# EasyEDA Pro project can-mcu.eprj, schematic host-dev
Board Name: host-dev; Create Date: 2026-08-12; Page Name: P1; Project Name: can-mcu; Schematic Name: host-dev; Update Date: 2026-09-03; Company: EasyEDA.com; Page Size: A4; Version: V1.0
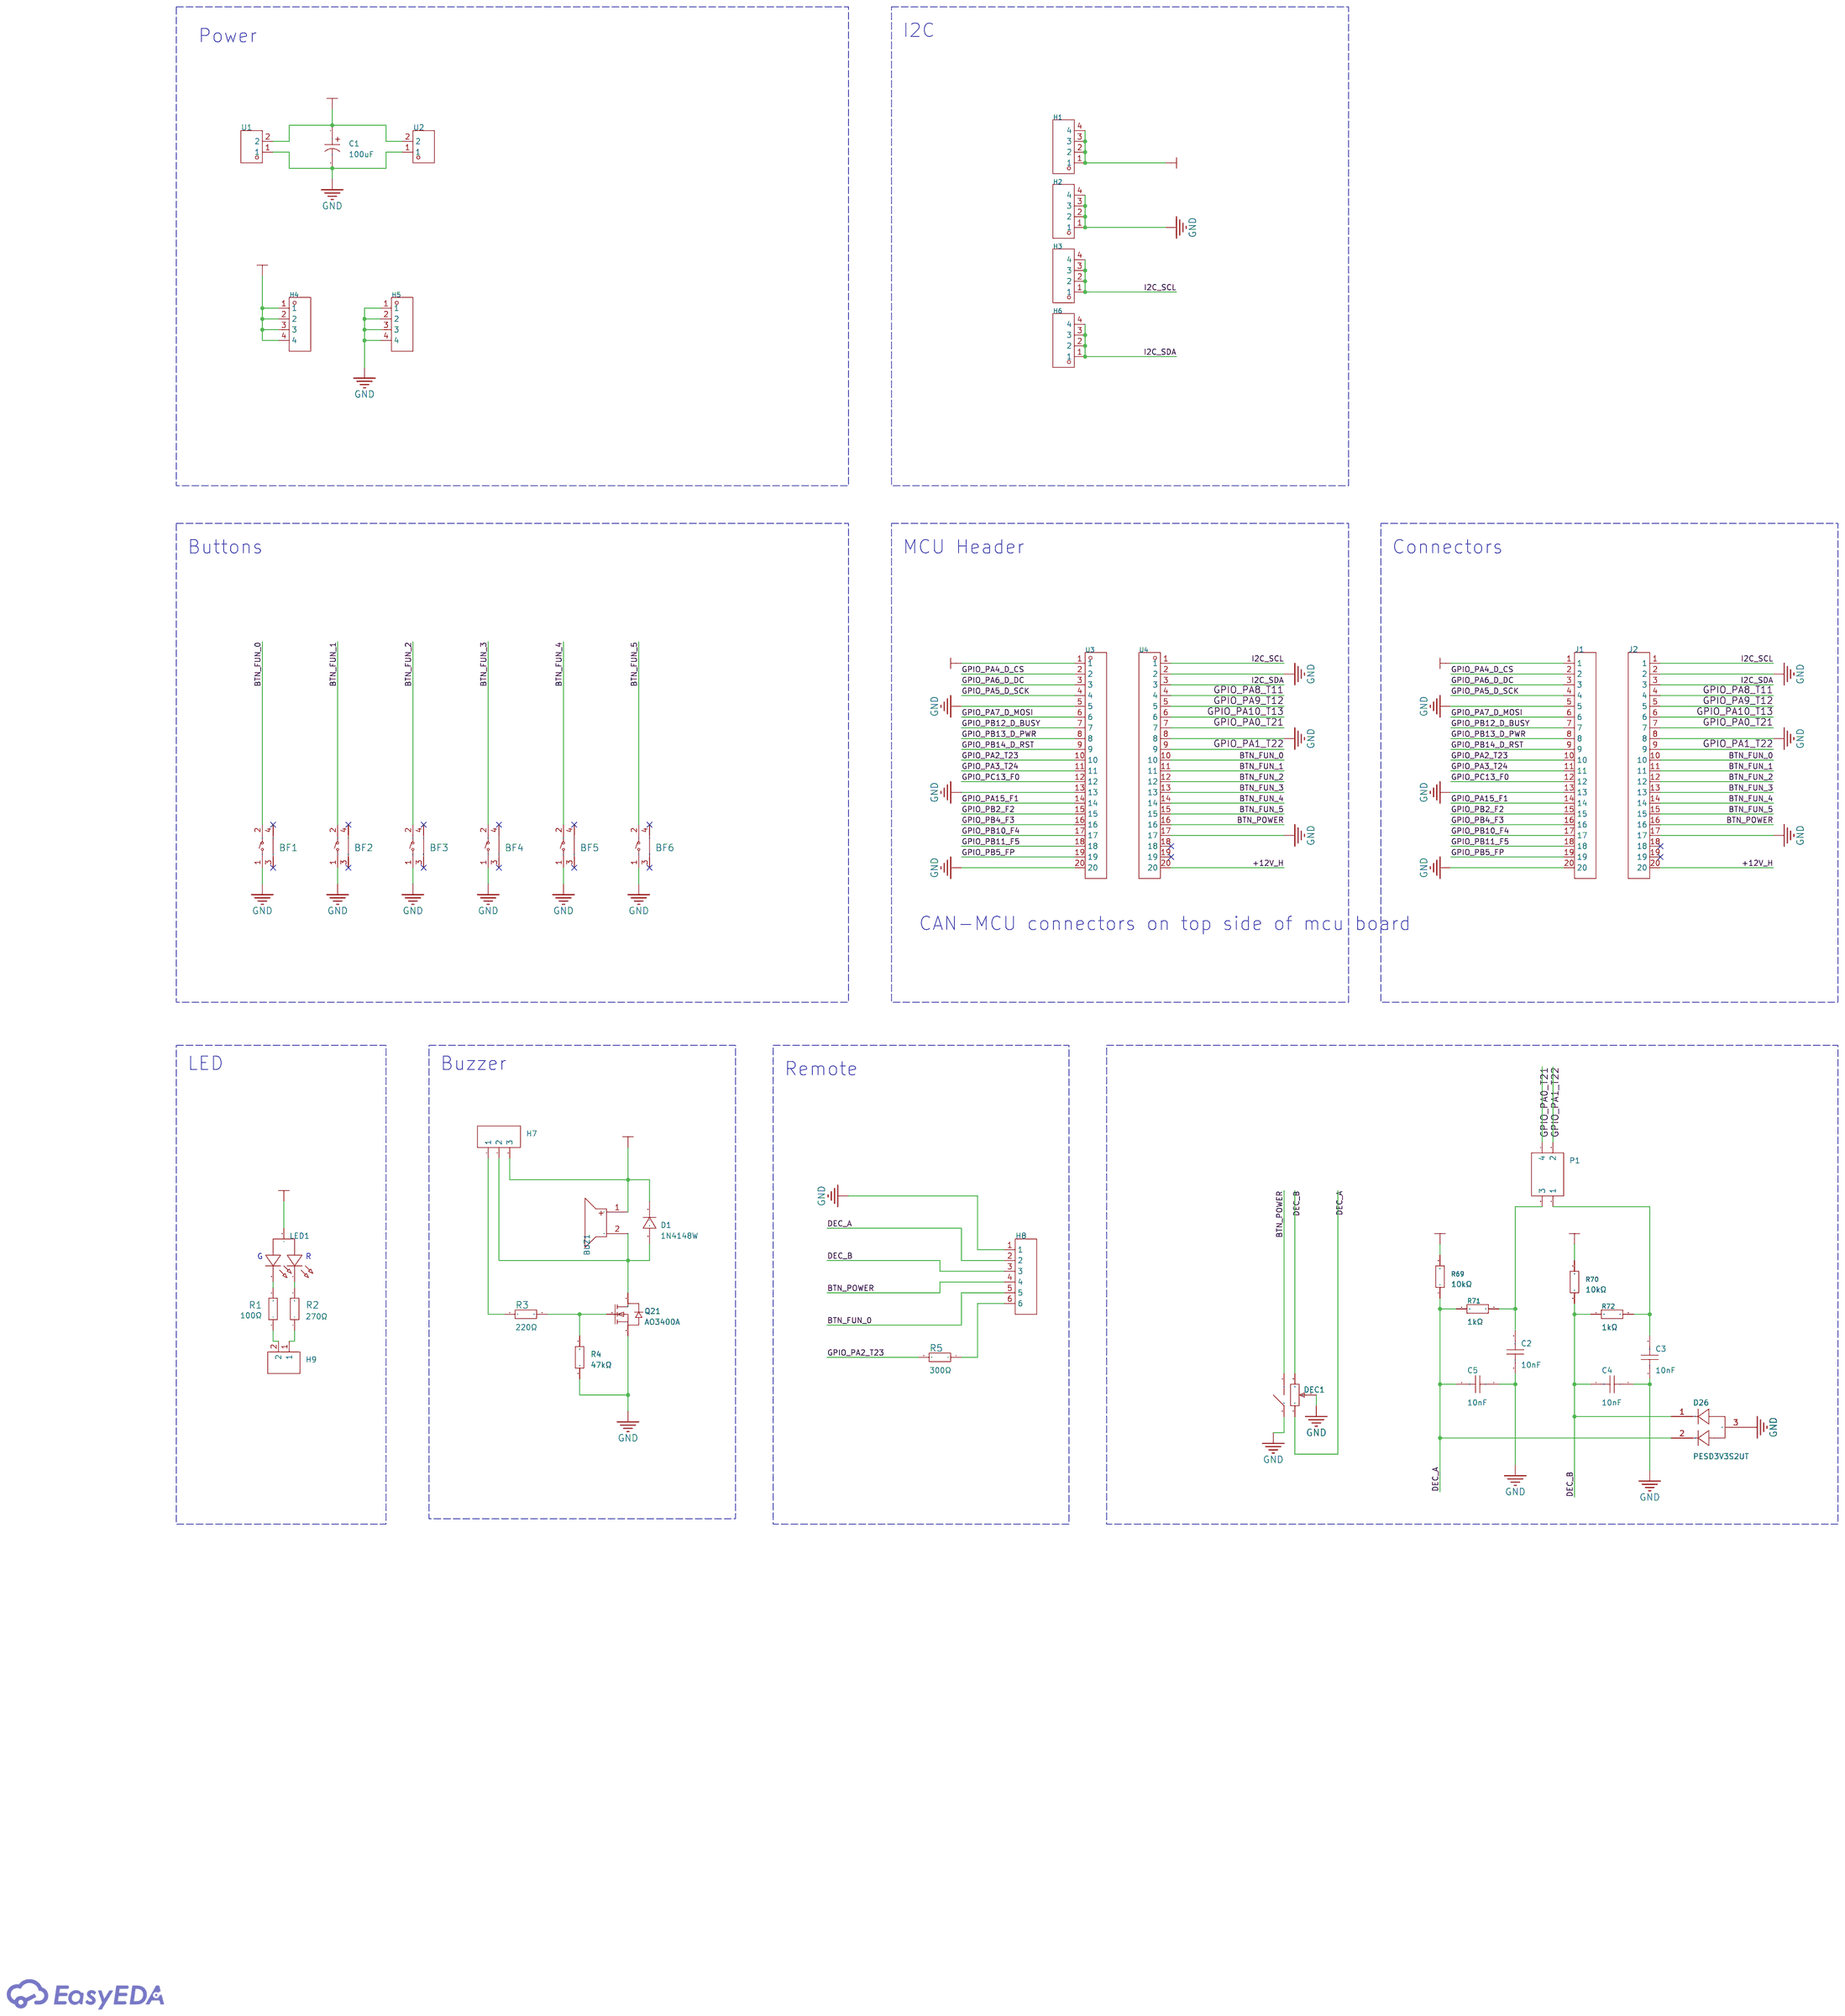
[diagram p2: schematic sheet]

## Parts
BF1  TC-6615-8-260G  [SW-TH_4P-L7.5-W8.0-P4.50]
BF2  TC-6615-8-260G  [SW-TH_4P-L7.5-W8.0-P4.50]
BF3  TC-6615-8-260G  [SW-TH_4P-L7.5-W8.0-P4.50]
BF4  TC-6615-8-260G  [SW-TH_4P-L7.5-W8.0-P4.50]
BF5  TC-6615-8-260G  [SW-TH_4P-L7.5-W8.0-P4.50]
BF6  TC-6615-8-260G  [SW-TH_4P-L7.5-W8.0-P4.50]
BUZ1  2.7kHz  [BUZ-TH_BD9.0-P4.00-D0.6-FD]
C1  100uF  [CAP-SMD_BD6.3-L6.6-W6.6-LS7.3-FD-H7.7]
C2  10nF  [C1206]
C3  10nF  [C1206]
C4  10nF  [C1206]
C5  10nF  [C1206]
D1  1N4148W  [SOD-123_L2.8-W1.8-LS3.7-RD]
D26  PESD3V3S2UT  [SOT-23-3_L2.9-W1.3-P1.90-LS2.4-BR]
DEC1  PEC09-2120K-T0012  [SW-TH_PEC09-2120K-T0012]
H1  PZ254V-11-04P  [HDR-TH_4P-P2.54-V-M]
H2  PZ254V-11-04P  [HDR-TH_4P-P2.54-V-M]
H3  PZ254V-11-04P  [HDR-TH_4P-P2.54-V-M]
H4  PZ254V-11-04P  [HDR-TH_4P-P2.54-V-M]
H5  PZ254V-11-04P  [HDR-TH_4P-P2.54-V-M]
H6  PZ254V-11-04P  [HDR-TH_4P-P2.54-V-M]
H7  2.54-1*3P针  [HDR-TH_3P-P2.54-V-M-1]
H8  PZ254V-11-06P  [HDR-TH_6P-P2.54-V-M]
H9  PH2.54-1X2P-H25  [HDR-TH_2P-P2.54-V-M-4]
J1  2.54-1*20P直针  [HDR-TH_20P-P2.54-V-M-1]  (no BOM)
J2  2.54-1*20P直针  [HDR-TH_20P-P2.54-V-M-1]  (no BOM)
LED1  TZ-LAMP03RG4HD-A  [LED-TH_3P-BD3.9-P2.54-R-BI]
P1  2.54-2*2P针  [HDR-TH_4P-P2.54-V-M-R2-C2-S2.54-1]
Q21  AO3400A  [SOT-23-3_L2.9-W1.3-P1.90-LS2.4-BR]
R1  100Ω  [R1206]
R2  270Ω  [R1206]
R3  220Ω  [R1206]
R4  47kΩ  [R1206]
R5  300Ω  [R1206]
R69  10kΩ  [R1206]
R70  10kΩ  [R1206]
R71  1kΩ  [R1206]
R72  1kΩ  [R1206]
U1  PZ508V-11-02P-H25  [HDR-TH_2P-P5.08-V-M]
U2  PZ508V-11-02P-H25  [HDR-TH_2P-P5.08-V-M]
U3  KH-2.54FH-1X20P-H8.5  [HDR-TH_20P-P2.54-V-F-2]
U4  KH-2.54FH-1X20P-H8.5  [HDR-TH_20P-P2.54-V-F-2]

## Library data of the parts
BF1-BF6 = TC-6615-8-260G: LCSC Part Name: 轻触6*6*8支架 插件260g; Supplier Part: C2845277; Manufacturer: HCTL(华灿天禄); Supplier Footprint: 插件; JLCPCB Part Class: Extended Part; Datasheet: https://item.szlcsc.com/datasheet/TC-6615-8-260G/3038944.html; Supplier: LCSC; Circuit: SPST; Actuator Style: Round Button; Operating Force: 2.6N; Mounting Type: Right Angle; Length: 6mm; Width: 6mm; Switch Height: 8mm; with Bracket: With Bracket; Contact Current: 50mA; Voltage Rating: 12V; Actuator/Cap Color: Black; With Lamp: No; Life: 100,000 Cycles; Operating Temperature: -25℃~+85℃
BUZ1 = QMB-09B-03: LCSC Part Name: 无源蜂鸣器QMB-09B-03; Supplier Part: C96256; Manufacturer: 华能; Supplier Footprint: 插件,D=9mm; Datasheet: https://item.szlcsc.com/datasheet/QMB-09B-03/97460.html; Supplier: LCSC; Driver Circuitry: Passive (Externally Driven); Technology: Electromagnetic; Voltage Rating: 3V; Voltage - Supply: 2V~5V; Current Consumption: 50mA; Sound Pressure Level(SPL): 85dB; Diameter(φD): 9mm; Height: 5.7mm; Operating Temperature: -20℃~+70℃
C1 = RVT50V100M6X8: LCSC Part Name: 100uF ±20% 50V; Supplier Part: C47023117; Manufacturer: JIERR(捷而瑞); Supplier Footprint: SMD,D6.3xL7.7mm; Datasheet: https://item.szlcsc.com/datasheet/RVT50V100M6X8/49206218.html; Supplier: LCSC; Tolerance: ±20%; Voltage Rating: 50V; Ripple Current: 146mA@120Hz; Diameter: 6.3mm; Height - Seated (Max): 7.7mm; Lifetime: 2000hrs@105℃; Operating Temperature: -40℃~+105℃
C2-C5 = FV31X103K102ECG: LCSC Part Name: 10nF ±10% 1kV; Supplier Part: C394163; Manufacturer: PSA(信昌电陶); Supplier Footprint: 1206; JLCPCB Part Class: Extended Part; Datasheet: https://item.szlcsc.com/datasheet/FV31X103K102ECG/373019.html; Supplier: LCSC; Tolerance: ±10%; Voltage Rating: 1kV; Temperature Coefficient: X7R
D1 = 1N4148W_C2099: LCSC Part Name: 丝印T4 100V 150mA; Supplier Part: C2099; Manufacturer: CJ(江苏长电/长晶); Supplier Footprint: SOD-123; JLCPCB Part Class: Extended Part; Datasheet: https://item.szlcsc.com/datasheet/1N4148W/2456.html; Supplier: LCSC; Diode Configuration: Standalone; Pd - Power Dissipation: 500mW; Current - Rectified: 150mA; Voltage - DC Reverse(Vr): 100V; Voltage - Forward(Vf@If): 1.25V@150mA; Non-Repetitive Peak Forward Surge Current: 2A; Reverse Leakage Current (Ir): 1uA@75V; Reverse Recovery Time (trr): 4ns
D26 = PESD3V3S2UT_C2687120: Supplier Part: C2687120; Manufacturer: UMW(友台半导体); Supplier Footprint: SOT-23; Datasheet: https://atta.szlcsc.com/upload/public/pdf/source/20231109/FA9807058B22500FF1E22196126D0E67.pdf; Supplier: LCSC
DEC1 = PEC09-2120K-T0012: Supplier Part: C23476912; Manufacturer: BOURNS; Supplier Footprint: 插件; JLCPCB Part Class: Extended Part; Datasheet: https://item.szlcsc.com/datasheet/PEC09-2120K-T0012/25205803.html; Supplier: LCSC; Height: 11.35mm
H1-H6 = PZ254V-11-04P: LCSC Part Name: 1x4P 间距:2.54mm 方针 直插; Supplier Part: C2691448; Manufacturer: XFCN(兴飞); Supplier Footprint: 插件,P=2.54mm; JLCPCB Part Class: Extended Part; Datasheet: https://item.szlcsc.com/datasheet/PZ254V-11-04P/2801085.html; Supplier: LCSC; Pin Structure: 1x4P; Pitch: 2.54mm; Circluar Pins/Square Pins: Pin Header; Mounting Type: Through Hole; Number of Rows: 1; Number of Pins: 4P; Current Rating: 3A; Voltage Rating (Max): 250V; Length of Mating Pin: 6mm; Insulation Height: 2.5mm; Length of End Connection Pin: 3mm; Operating Temperature: -40℃~+105℃; Color: Black
H7 = 2.54-1*3P针: LCSC Part Name: 1x3P 间距:2.54mm 方针 直插; Supplier Part: C49257; Manufacturer: BOOMELE(博穆精密); Supplier Footprint: 插件,P=2.54mm; Datasheet: https://item.szlcsc.com/datasheet/2.54-1*3P%25E9%2592%2588/50265.html; Supplier: LCSC; Pin Structure: 1x3P; Pitch: 2.54mm; Circluar Pins/Square Pins: Pin Header; Mounting Type: Through Hole; Number of Rows: 1; Number of Pins: 3P; Current Rating: 3A; Length of Mating Pin: 6mm; Insulation Height: 2.5mm; Length of End Connection Pin: 3mm; Contact Material: Brass; Contact Plating: Gold; Operating Temperature: -40℃~+105℃; Color: Black
H8 = PZ254V-11-06P: LCSC Part Name: 1x6P 间距:2.54mm 方针 直插; Supplier Part: C492405; Manufacturer: XFCN(兴飞); Supplier Footprint: 插件,P=2.54mm; JLCPCB Part Class: Extended Part; Datasheet: https://item.szlcsc.com/datasheet/PZ254V-11-06P/502961.html; Supplier: LCSC; Pin Structure: 1x6P; Pitch: 2.54mm; Circluar Pins/Square Pins: Pin Header; Mounting Type: Through Hole; Number of Rows: 1; Number of Pins: 6P; Current Rating: 3A; Voltage Rating (Max): 250V; Length of Mating Pin: 6mm; Insulation Height: 2.5mm; Length of End Connection Pin: 3mm; Contact Material: Brass; Operating Temperature: -40℃~+105℃; Color: Black
H9 = PH2.54-1X2P-H25: LCSC Part Name: 插针结构：1x2P 间距：2.54mm 安装方式：直插 排数：单排 方针; Supplier Part: C42431798; Manufacturer: JXTCONN(聚兴泰); Supplier Footprint: 插件,P=2.54mm; Datasheet: https://item.szlcsc.com/datasheet/PH2.54-1X2P-H25/44458928.html; Supplier: LCSC; Pin Structure: 1x2P; Pitch: 2.54mm; Circluar Pins/Square Pins: Pin Header; Mounting Type: Through Hole; Number of Rows: 1; Number of Pins: 2P; Current Rating: 3A; Voltage Rating (Max): 1kV; Length of Mating Pin: 6mm; Insulation Height: 2.5mm; Length of End Connection Pin: 3mm; Contact Material: Brass; Contact Plating: Gold; Operating Temperature: -40℃~+105℃; Color: Black
J1 J2 = 2.54-1*20P直针: LCSC Part Name: 1x20P 间距:2.54mm 方针 直插; Supplier Part: C50981; Manufacturer: BOOMELE(博穆精密); Supplier Footprint: 插件,P=2.54mm; JLCPCB Part Class: Extended Part; Datasheet: https://item.szlcsc.com/datasheet/2.54-1*20P%25E7%259B%25B4%25E9%2592%2588/51993.html; Supplier: LCSC; Pin Structure: 1x20P; Pitch: 2.54mm; Circluar Pins/Square Pins: Pin Header; Mounting Type: Through Hole; Number of Rows: 1; Number of Pins: 20P; Current Rating: 3A; Contact Material: Brass; Operating Temperature: -40℃~+105℃; Color: Black
LED1 = TZ-LAMP03RG4HD-A: LCSC Part Name: 红灯,翠绿; Supplier Part: C779416; Manufacturer: TUOZHAN(拓展光电); Supplier Footprint: 插件,D=3mm; Datasheet: https://item.szlcsc.com/datasheet/TZ-LAMP03RG4HD-A/829077.html; Supplier: LCSC; Lamp Holder Type: 3mm Round Lens; Illumination Color: Red, Emerald Green; Voltage - Forward(Vf): 1.8V~2.4V；2.8V~3.4V; Power(Watts): 90mW；60mW; Forward Current: 20mA; Wavelength - Dominant: 515nm~520nm；620nm~625nm; Diode Configuration: Common Anode; Luminous Intensity: 50mcd；1.5cd; Viewing Angle: 30°; Operating Temperature: -40℃~+80℃
P1 = 2.54-2*2P针: LCSC Part Name: 间距:2.54mm 方针 直插; Supplier Part: C66690; Manufacturer: BOOMELE(博穆精密); Supplier Footprint: 插件,P=2.54mm; Datasheet: https://item.szlcsc.com/datasheet/2.54-2*2P%25E9%2592%2588/67776.html; Supplier: LCSC; Pitch: 2.54mm; Row Spacing: 2.54mm; Circluar Pins/Square Pins: Pin Header; Mounting Type: Through Hole; Number of Rows: 2; Number of Pins: 4P; Current Rating: 3A; Length of Mating Pin: 6mm; Insulation Height: 2.5mm; Length of End Connection Pin: 3mm; Contact Material: Brass; Contact Plating: Gold; Operating Temperature: -55℃~+105℃; Color: Black
Q21 = AO3400A: LCSC Part Name: 1个N沟道 耐压:30V 电流:5.2A; Supplier Part: C700953; Manufacturer: HUASHUO(华朔); Supplier Footprint: SOT-23; Datasheet: https://item.szlcsc.com/datasheet/AO3400A/736021.html; Supplier: LCSC; Number: 1 N-channel; Drain to Source Voltage: 30V; Current - Continuous Drain(Id): 5.2A; RDS(on): 27mΩ@4.5V; Pd - Power Dissipation: 1W; Gate Threshold Voltage (Vgs(th)): 850mV; Gate Charge(Qg): 11.7nC@4.5V; Input Capacitance(Ciss): 927pF; Reverse Transfer Capacitance (Crss@Vds): 61pF; Operating Temperature: -55℃~+150℃; Type: N-Channel; Vgs: ±12V
R1 = 1206W4F1000T5E_C17901: Type:Thick Film Resistor Resistance:100Ω Tolerance:±1% Tolerance:±1% Power(Watts):250mW Voltage-Supply(Max):200V Temperature Coefficient:±100ppm/℃ Temperature Coefficient:±100ppm/℃ Operating Temperature:-55℃~+155℃ Operating Temperature:-55℃~+155℃; LCSC Part Name: 100Ω ±1% 250mW 厚膜电阻; Supplier Part: C17901; Manufacturer: UNI-ROYAL(厚声); Manufacturer Part: 1206W4F1000T5E; Supplier Footprint: 1206; JLCPCB Part Class: Basic Part; Datasheet: https://item.szlcsc.com/datasheet/1206W4F1000T5E/18589.html; Supplier: LCSC; Type: Thick Film Resistor; Tolerance: ±1%; Power(Watts): 250mW; Voltage-Supply(Max): 200V; Temperature Coefficient: ±100ppm/℃; Operating Temperature: -55℃~+155℃
R2 = 1206W4F2700T5E: Type:Thick Film Resistor Resistance:270Ω Tolerance:±1% Tolerance:±1% Power(Watts):250mW Voltage-Supply(Max):200V Temperature Coefficient:±100ppm/℃ Temperature Coefficient:±100ppm/℃ Operating Temperature:-55℃~+155℃ Operating Temperature:-55℃~+155℃; LCSC Part Name: 270Ω ±1% 250mW 厚膜电阻; Supplier Part: C4466; Manufacturer: UNI-ROYAL(厚声); Supplier Footprint: 1206; JLCPCB Part Class: Extended Part; Datasheet: https://item.szlcsc.com/datasheet/1206W4F2700T5E/4873.html; Supplier: LCSC; Type: Thick Film Resistor; Tolerance: ±1%; Power(Watts): 250mW; Voltage-Supply(Max): 200V; Temperature Coefficient: ±100ppm/℃; Operating Temperature: -55℃~+155℃
R3 = FRC1206J221 TS: Type:Thick Film Resistor Resistance:220Ω Tolerance:±5% Tolerance:±5% Power(Watts):250mW Voltage-Supply(Max):200V Temperature Coefficient:±100ppm/℃ Temperature Coefficient:±100ppm/℃ Operating Temperature:-55℃~+155℃ Operating Temperature:-55℃~+155℃; LCSC Part Name: 220Ω ±5% 250mW 厚膜电阻; Supplier Part: C2933785; Manufacturer: FOJAN(富捷); Supplier Footprint: 1206; JLCPCB Part Class: Extended Part; Datasheet: https://item.szlcsc.com/datasheet/FRC1206J221%2520TS/3279887.html; Supplier: LCSC; Type: Thick Film Resistor; Tolerance: ±5%; Power(Watts): 250mW; Voltage-Supply(Max): 200V; Temperature Coefficient: ±100ppm/℃; Operating Temperature: -55℃~+155℃
R4 = RC1206FR-0747KL: Type:Thick Film Resistor Resistance:47kΩ Tolerance:±1% Tolerance:±1% Power(Watts):250mW Voltage-Supply(Max):200V Temperature Coefficient:±100ppm/℃ Temperature Coefficient:±100ppm/℃ Operating Temperature:-55℃~+155℃ Operating Temperature:-55℃~+155℃; LCSC Part Name: 厚膜电阻 47kΩ ±1% 250mW; Supplier Part: C137270; Manufacturer: YAGEO(国巨); Supplier Footprint: 1206; JLCPCB Part Class: Extended Part; Datasheet: https://item.szlcsc.com/datasheet/RC1206FR-0747KL/148586.html; Supplier: LCSC; Type: Thick Film Resistor; Tolerance: ±1%; Power(Watts): 250mW; Voltage-Supply(Max): 200V; Temperature Coefficient: ±100ppm/℃; Operating Temperature: -55℃~+155℃
R5 = 1206W4F3000T5E: Type:Thick Film Resistor Resistance:300Ω Tolerance:±1% Tolerance:±1% Power(Watts):250mW Voltage-Supply(Max):200V Temperature Coefficient:±100ppm/℃ Temperature Coefficient:±100ppm/℃ Operating Temperature:-55℃~+155℃ Operating Temperature:-55℃~+155℃; LCSC Part Name: 300Ω ±1% 250mW 厚膜电阻; Supplier Part: C17887; Manufacturer: UNI-ROYAL(厚声); Supplier Footprint: 1206; JLCPCB Part Class: Basic Part; Datasheet: https://item.szlcsc.com/datasheet/1206W4F3000T5E/18575.html; Supplier: LCSC; Type: Thick Film Resistor; Tolerance: ±1%; Power(Watts): 250mW; Voltage-Supply(Max): 200V; Temperature Coefficient: ±100ppm/℃; Operating Temperature: -55℃~+155℃
R69 R70 = 1206W4F1002T5E: LCSC Part Name: 10kΩ ±1% 250mW 厚膜电阻; Supplier Part: C17902; Manufacturer: UNI-ROYAL(厚声); Supplier Footprint: 1206; JLCPCB Part Class: Basic Part; Datasheet: https://item.szlcsc.com/datasheet/1206W4F1002T5E/18590.html; Supplier: LCSC; Type: Thick Film Resistor; Tolerance: ±1%; Power(Watts): 250mW; Voltage-Supply(Max): 200V; Temperature Coefficient: ±100ppm/℃; Operating Temperature: -55℃~+155℃
R71 R72 = 1206W4F1001T5E_C4410: LCSC Part Name: 1kΩ ±1% 250mW 厚膜电阻; Supplier Part: C4410; Manufacturer: UNI-ROYAL(厚声); Manufacturer Part: 1206W4F1001T5E; Supplier Footprint: 1206; JLCPCB Part Class: Basic Part; Datasheet: https://item.szlcsc.com/datasheet/1206W4F1001T5E/4817.html; Supplier: LCSC; Type: Thick Film Resistor; Tolerance: ±1%; Power(Watts): 250mW; Voltage-Supply(Max): 200V; Temperature Coefficient: ±100ppm/℃; Operating Temperature: -55℃~+155℃
U1 U2 = PZ508V-11-02P-H25: LCSC Part Name: 1x2P 间距:5.08mm 方针 直插; Supplier Part: C25170858; Manufacturer: XFCN(兴飞); Supplier Footprint: 插件,P=5.08mm; JLCPCB Part Class: Extended Part; Datasheet: https://item.szlcsc.com/datasheet/PZ508V-11-02P-H25/26900548.html; Supplier: LCSC; Pin Structure: 1x2P; Pitch: 5.08mm; Circluar Pins/Square Pins: Pin Header; Mounting Type: Through Hole; Number of Rows: 1; Number of Pins: 2P; Current Rating: 7A; Length of Mating Pin: 8mm; Insulation Height: 2.5mm; Length of End Connection Pin: 3.5mm; Contact Material: Brass; Operating Temperature: -40℃~+105℃
U3 U4 = KH-2.54FH-1X20P-H8.5: LCSC Part Name: 间距:2.54mm 1x20P 直插; Supplier Part: C2905423; Manufacturer: kinghelm(金航标); Supplier Footprint: 插件,P=2.54mm; Datasheet: https://item.szlcsc.com/datasheet/KH-2.54FH-1X20P-H8.5/3175197.html; Supplier: LCSC; Holes Structure: 1x20P; Pitch: 2.54mm; Circular Hole / Square Hole: Square Hole; Mounting Type: Through Hole; Number of Rows: 1; Number of Positions: 20P; Current Rating: 3A; Holes Direction: Top; Insulation Height: 8.5mm; Operating Temperature: -40℃~+105℃

## Nets
+3V3: BUZ1.1 D1.1(K) H1.1 H1.2 H1.3 H1.4 H4.1 H4.2 H4.3 H4.4 H7.3 J1.1 LED1.2(+) R69.2 R70.2 U3.1
+12V: C1.1 U1.2 U2.2
+12V_H: J2.20 U4.20
GND: BF1.1 BF2.1 BF3.1 BF4.1 BF5.1 BF6.1 C1.2 C2.1 C3.1 C4.1 C5.1 D26.3 DEC1.B DEC1.D H2.1 H2.2 H2.3 H2.4 H5.1 H5.2 H5.3 H5.4 H8.1 J1.5 J1.13 J1.20 J2.2 J2.8 J2.17 Q21.2(S) R4.1 U1.1 U2.1 U3.5 U3.13 U3.20 U4.2 U4.8 U4.17
BTN_FUN_0: BF1.2 H8.5 J2.10 U4.10
BTN_FUN_1: BF2.2 J2.11 U4.11
BTN_FUN_2: BF3.2 J2.12 U4.12
BTN_FUN_3: BF4.2 J2.13 U4.13
BTN_FUN_4: BF5.2 J2.14 U4.14
BTN_FUN_5: BF6.2 J2.15 U4.15
BTN_POWER: DEC1.E H8.4 J2.16 U4.16
DEC_A: C5.2 D26.2 DEC1.A H8.2 R69.1 R71.1
DEC_B: C4.2 D26.1 DEC1.C H8.3 R70.1 R72.1
GPIO_PA0_T21: J2.7 P1.4 U4.7
GPIO_PA1_T22: J2.9 P1.2 U4.9
GPIO_PA2_T23: J1.10 R5.2 U3.10
GPIO_PA3_T24: J1.11 U3.11
GPIO_PA4_D_CS: J1.2 U3.2
GPIO_PA5_D_SCK: J1.4 U3.4
GPIO_PA6_D_DC: J1.3 U3.3
GPIO_PA7_D_MOSI: J1.6 U3.6
GPIO_PA8_T11: J2.4 U4.4
GPIO_PA9_T12: J2.5 U4.5
GPIO_PA10_T13: J2.6 U4.6
GPIO_PA15_F1: J1.14 U3.14
GPIO_PB2_F2: J1.15 U3.15
GPIO_PB4_F3: J1.16 U3.16
GPIO_PB5_FP: J1.19 U3.19
GPIO_PB10_F4: J1.17 U3.17
GPIO_PB11_F5: J1.18 U3.18
GPIO_PB12_D_BUSY: J1.7 U3.7
GPIO_PB13_D_PWR: J1.8 U3.8
GPIO_PB14_D_RST: J1.9 U3.9
GPIO_PC13_F0: J1.12 U3.12
I2C_SCL: H3.1 H3.2 H3.3 H3.4 J2.1 U4.1
I2C_SDA: H6.1 H6.2 H6.3 H6.4 J2.3 U4.3
$1N3237: LED1.1(-) R2.2
$1N3240: H9.1 R2.1
$1N3317: LED1.3(-) R1.2
$1N3320: H9.2 R1.1
$1N6097: BUZ1.2 D1.2(A) H7.2 Q21.3(D)
$1N6541: H7.1 R3.1
$1N6717: Q21.1(G) R3.2 R4.2
$1N12953: H8.6 R5.1
$1N16107: C2.2 P1.3 R71.2
$1N16250: C3.2 P1.1 R72.2

Not connected (* = marked no-connect by the designer): BF1 3* 4*; BF2 3* 4*; BF3 3* 4*; BF4 3* 4*; BF5 3* 4*; BF6 3* 4*; J2 18* 19*; U4 18* 19*

## Notes on the sheet
- Power
- I2C
- Buttons
- MCU Header
- Connectors
- CAN-MCU connectors on top side of mcu board
- LED
- Buzzer
- Remote
- G
- R
